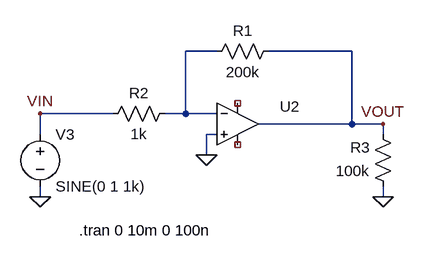
[diagram p0: schematic Universal_Inverter.asc]
Universal_Inverter.asc, the LTspice schematic file:
Version 4
SHEET 1 996 680
WIRE 528 48 480 48
WIRE 736 48 608 48
WIRE 368 144 256 144
WIRE 480 144 480 48
WIRE 480 144 448 144
WIRE 528 144 480 144
WIRE 736 160 736 48
WIRE 736 160 592 160
WIRE 784 160 736 160
WIRE 256 176 256 144
WIRE 528 176 512 176
WIRE 784 176 784 160
WIRE 512 208 512 176
WIRE 256 272 256 256
WIRE 784 272 784 256
FLAG 256 272 0
FLAG 512 208 0
FLAG 784 272 0
FLAG 256 144 VIN
FLAG 784 160 VOUT
SYMBOL res 624 32 R90
WINDOW 0 0 56 VBottom 2
WINDOW 3 32 56 VTop 2
SYMATTR InstName R1
SYMATTR Value 200k
SYMBOL res 464 128 R90
WINDOW 0 0 56 VBottom 2
WINDOW 3 32 56 VTop 2
SYMATTR InstName R2
SYMATTR Value 1k
SYMBOL res 800 272 R180
WINDOW 0 36 76 Left 2
WINDOW 3 36 40 Left 2
SYMATTR InstName R3
SYMATTR Value 100k
SYMBOL voltage 256 160 R0
WINDOW 123 0 0 Left 0
WINDOW 39 0 0 Left 0
SYMATTR InstName V3
SYMATTR Value SINE(0 1 1k)
SYMBOL OpAmps\\UniversalOpAmp 560 160 R0
WINDOW 0 65 -27 Left 2
SYMATTR InstName U2
TEXT 316 324 Left 2 !.tran 0 10m 0 100n

The netlist it stands for:
* Universal_Inverter.asc
R1 VOUT N001 200k
R2 N001 VIN 1k
R3 0 VOUT 100k
V3 VIN 0 SINE(0 1 1k)
XU2 0 N001 NC_01 NC_02 VOUT level1 Avol=1Meg GBW=10Meg Vos=0 En=0 Enk=0 In=0 Ink=0 Rin=500Meg  ; pins In+ In- V+ V- OUT
.tran 0 10m 0 100n
.lib UniversalOpAmp1.lib
.backanno
.end